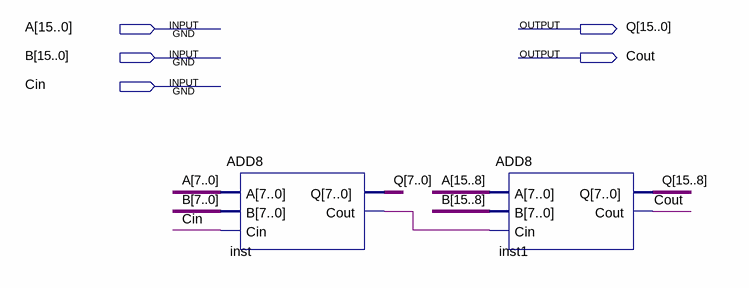
[diagram p0: schematic sheet]
// Quartus schematic ADD16.bdf as structural Verilog: 2 symbols, 5 pins
module ADD16 (
  input  [15:0] A,
  input  [15:0] B,
  input  Cin,
  output [15:0] Q,
  output Cout
);

  wire inst_cout;

  ADD8 inst (.A(A[7:0]), .B(B[7:0]), .Cin(Cin), .Q(Q[7:0]), .Cout(inst_cout));
  ADD8 inst1 (.A(A[15:8]), .B(B[15:8]), .Cin(inst_cout), .Q(Q[15:8]), .Cout(Cout));
endmodule
